# EAGLE design valve board-OSH2 (EAGLE 7.6.0)
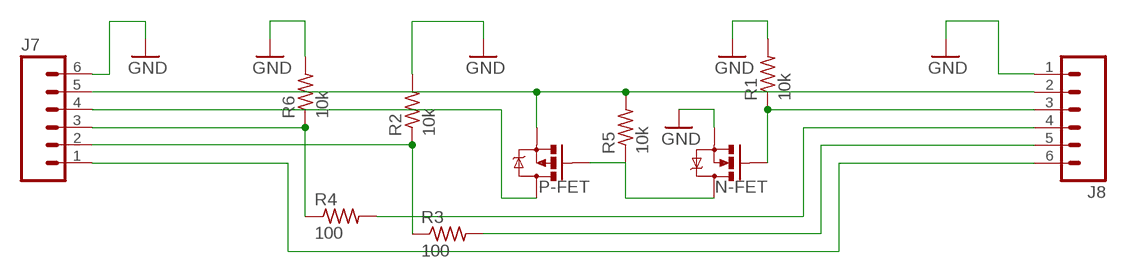
[diagram p0: schematic, sheet 1]

## Parts
J7  M06LOCK_LONGPADS  [1X06_LOCK_LONGPADS]
J8  M06LOCK_LONGPADS  [1X06_LOCK_LONGPADS]
N-FET  MOSFET-NCHANNELFQP30N06L  [TO220V]
P-FET  MOSFET-PCHANNELFQP27P06  [TO220V]
R1  10k  R-US_0207/10  [0207/10]
R2  10k  R-US_0207/10  [0207/10]
R3  100  R-US_0207/10  [0207/10]
R4  100  R-US_0207/10  [0207/10]
R5  10k  R-US_0207/10  [0207/10]
R6  10k  R-US_0207/10  [0207/10]

## Nets
GND: J7.6 J8.1 N-FET.3(S) R1.2 R2.2 R6.2
N$1: J8.4 R4.2
N$2: J8.5 R3.2
N$3: J7.4 P-FET.2(D)
N$4: J7.5 J8.2 P-FET.3(S) R5.2
N$6: J7.2 R2.1 R3.1
N$7: N-FET.2(D) P-FET.1(G) R5.1
N$9: J8.3 N-FET.1(G) R1.1
N$10: J7.3 R4.1 R6.1
N$12: J7.1 J8.6

## Library data of the parts
J7 J8 = SparkFun-Connectors:M06: Header 6 Standard 6-pin 0.1" header. Use with straight break away headers (SKU : PRT-00116), right angle break away headers (PRT-00553), swiss pins (PRT-00743), machine pins (PRT-00117), and female headers (PRT-00115). Molex polarized connector foot print use with SKU : PRT-08094 with associated crimp pins and housings. NOTES ON THE VARIANTS LOCK and LOCK_LONGPADS... This footprint was designed to help hold the alignment of a through-hole component (i.e. 6-pin header) while soldering it into place. You may notice that each hole has been shifted either up or down by 0.005 of an inch from it's more standard position (which is a perfectly straight line). This slight alteration caused the pins (the squares in the middle) to touch the edges of the holes. Because they are alternating, it causes a "brace" to hold the component in place. 0.005 has proven to be the perfect amount of "off-center" position when using our standard breakaway headers. Although looks a little odd when you look at the bare footprint, once you have a header in there, the alteration is very hard to notice. Also,if you push a header all the way into place, it is covered up entirely on the bottom side. This idea of altering the position of holes to aid alignment will be further integrated into the Sparkfun Library for other footprints. It can help hold any component with 3 or more connection pins.
N-FET = SparkFun-DiscreteSemi:MOSFET-NCHANNEL: Common NMOSFET Parts MFG P/N Store ID Prod ID FDD8780 TRANS-09984 SI7820DN TRANS-11055 FDS6630A IC-08089 2N7002PW TRANS-11151 FQP30N06L COM-10213 TRANS-10060 BSS123LT1G TRANS-08345 BSS138 TRANS-00830 BS170 2N7000; PROD_ID: TRANS-10060
P-FET = SparkFun-DiscreteSemi:MOSFET-PCHANNEL: Generic PMOSFET IRLML2244 - TRANS-11153 (SOT-23 -20V -4.3A) (1.Gate 2.Source 3.Drain) FQP27P06 - COM-10349 <http://www.sparkfun.com/products/10349> (TO-220 -60V -27A) (1.Gate 2.Source 3.Drain)
R1-R6 = resistor:R-US_: RESISTOR, American symbol

## Board
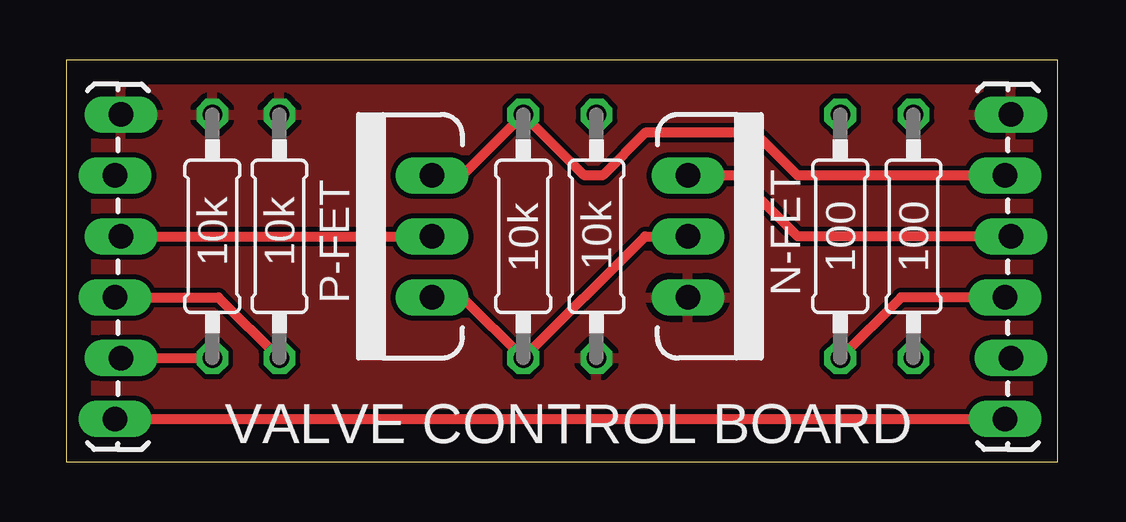
[diagram p1: board, top side]
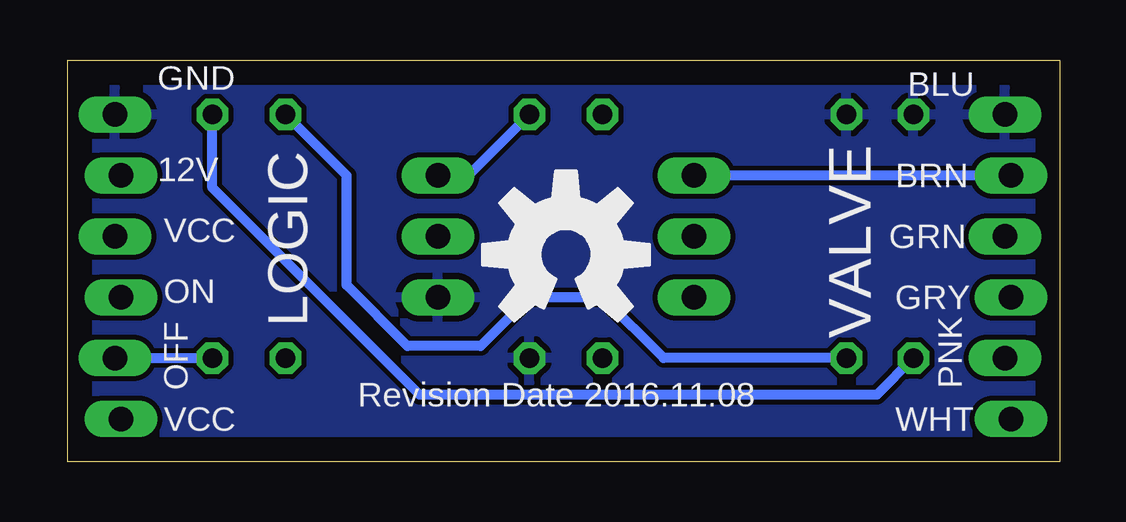
[diagram p2: board, bottom side, seen from below]

Size 41.33 x 16.75 mm. Coordinates in mm from the lower left corner, seen from the top.
Outline: 0,0 41.33,0 41.33,16.75 0,16.75 0,0
Copper layers (1*16): Top 0.035mm / dielectric 1.5mm / Bottom 0.035mm
Design rules "default": minimum track width 10mil, minimum drill 24mil, track to track 8mil, track to pad 8mil, pad to pad 8mil, via to via 8mil, smd to smd 8mil, copper to edge 40mil, drill to drill 8mil, minimum pad ring 10mil, minimum via ring 8mil, stop-mask expansion 4mil, vias tented up to drill 0mil, thermal gap 10mil

### Footprints (pad centres in the part's own frame; a part is rotated, then mirrored left to right if it is on the bottom)
1X06_LOCK_LONGPADS = drill 1.016 long: 1 0,0; 2 2.54,-0.254; 3 5.08,0; 4 7.62,-0.254; 5 10.16,0; 6 12.7,-0.254
TO220V = drill 1.016 long: 1 -2.54,0; 2 0,0; 3 2.54,0
0207/10 = drill 0.813 octagon: 1 -5.08,0; 2 5.08,0

### Placement (x,y rotation side)
J7  2.03,1.78 90 top
J8  39.37,14.48 270 top
N-FET  25.91,9.4 270 top
P-FET  15.24,9.4 90 top
R1  22.1,9.4 270 top
R2  6.1,9.4 90 top
R3  35.31,9.4 270 top
R4  32.26,9.4 270 top
R5  19.05,9.4 90 top
R6  8.89,9.4 90 top
U$1  [OSHW-LOGO-L]  20.57,8.64 0 bottom

### Tracks (layer width: path | path; a pad name or v marks a point on that pad's centre or on a via)
GND
  pour Bottom: 0,16.76 41.4,16.76 41.4,0 0,0
  pour Top: 0,16.76 41.4,16.76 41.4,0 0,0
N$1
  Top 0.406: J8.4 34.8,6.86 R4.2
N$2
  Bottom 0.406: J8.5 R3.2
N$3
  Top 0.406: J7.4 P-FET.2
N$4
  Top 0.406: P-FET.3 16.51,11.94 R5.2 21.59,11.94 22.35,11.94 24.13,13.72 28.7,13.72 30.48,11.94 J8.2
  Bottom 0.406: J7.5 P-FET.3
N$6
  Top 0.406: J7.2 R2.1
  Bottom 0.406: R2.1 7.62,2.79 26.67,2.79 35.31,11.43 R3.1
N$7
  Top 0.406: P-FET.1 16.51,6.86 R5.1 24.13,9.4 N-FET.2
N$9
  Top 0.406: J8.3 30.48,9.4 27.94,11.94 N-FET.1
  Bottom 0.406: N-FET.1 24.64,11.94 R1.1
N$10
  Top 0.406: J7.3 6.35,6.86 R6.1
  Bottom 0.406: R6.1 16.51,4.32 19.05,6.86 22.1,6.86 24.13,4.83 27.18,4.83 29.72,7.37 29.72,11.94 R4.1
N$12
  Top 0.406: J7.1 J8.6

### Text on the board
tPlace: VALVE CONTROL BOARD
bNames: BLU | GND | VALVE | LOGIC | 12V | BRN | GRN | VCC | GRY | OFF | ON | PNK | Revision Date 2016.11.08 | WHT | VCC